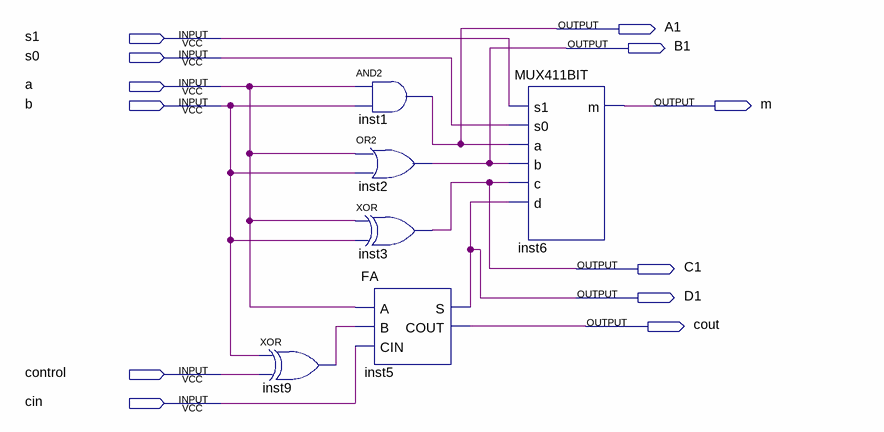
[diagram p0: schematic sheet]
// Quartus schematic ALU1BIT4CN.bdf as structural Verilog: 6 symbols, 12 pins
module ALU1BIT4CN (
  input  s1,
  input  s0,
  input  a,
  input  b,
  input  control,
  input  cin,
  output A1,
  output B1,
  output m,
  output C1,
  output D1,
  output cout
);

  wire inst9_out;

  xor inst9 (inst9_out, b, control);
  and inst1 (A1, a, b);
  or inst2 (B1, a, b);
  xor inst3 (C1, a, b);
  FA inst5 (.A(a), .B(inst9_out), .CIN(cin), .S(D1), .COUT(cout));
  MUX411BIT inst6 (.s1(s1), .s0(s0), .a(A1), .b(B1), .c(C1), .d(D1), .m(m));
endmodule
